# Altium schematic sheet RADIO.SchDoc: uBlox Radio
size A4; Organization: Altium Limited; Address1: L3, 12a Rodborough Rd; Address2: Frenchs Forest; Address3: NSW; Address4: Australia 2086
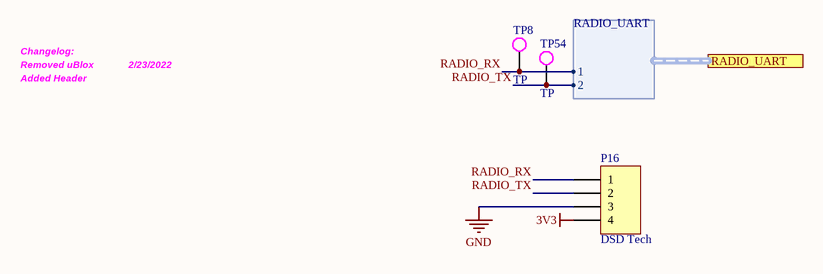
[diagram p0: RADIO.SchDoc]

## Parts
P16  DSD Tech  [HDR1X4]
TP8  TP  [Test_point]
TP54  TP  [Test_point]

## Ports
RADIO_UART (harness RADIO_UART)

## Harnesses
RADIO_UART: 1, 2

## Nets
3V3: P16.4
GND: P16.3
RADIO_RX: P16.1 TP8.1 ; port RADIO_UART.1
RADIO_TX: P16.2 TP54.1 ; port RADIO_UART.2

## Notes on the sheet
- Changelog:
- Removed uBlox
- Added Header
- 2/23/2022
- Title
- Date:
- RE:
- Arturo di Girolamo
- Size:
- A3
- A

## Library data of the parts
P16 = Header 4: Header, 4-Pin; LatestRevisionDate: 17-Jul-2002; LatestRevisionNote: Re-released for DXP Platform.; Publisher: Altium Limited
TP8 TP54 = TP_PCB: Test Point